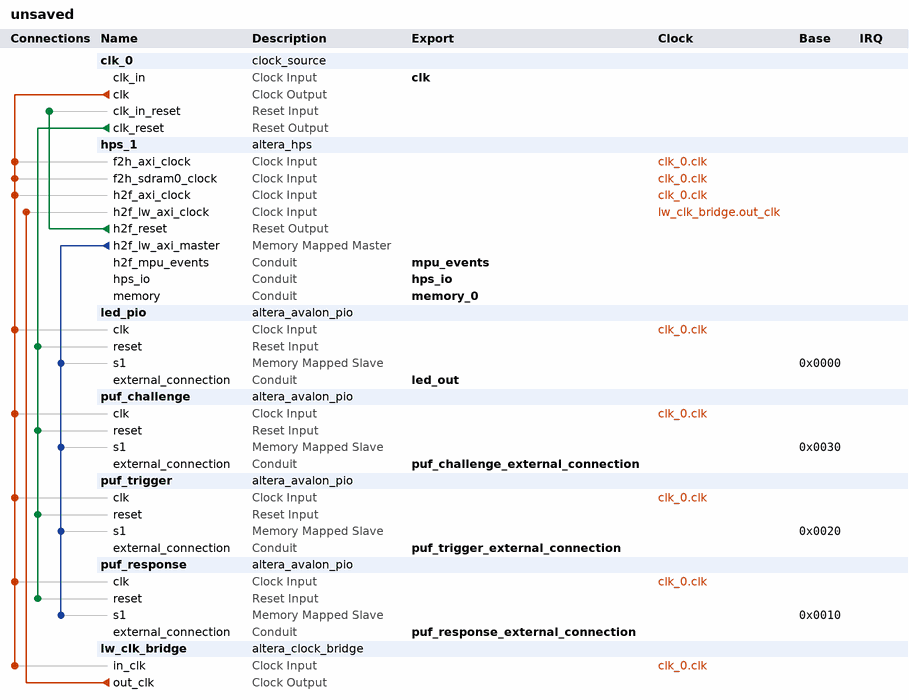
[diagram p0: system contents]
# Platform Designer (Qsys) system unsaved, Cyclone V 5CSEMA5F31C6
# Parameters at their usual value, and those the tool derives, are not listed.
package require -exact qsys 18.1
create_system unsaved
set_project_property DEVICE_FAMILY {Cyclone V}
set_project_property DEVICE 5CSEMA5F31C6

add_instance clk_0 clock_source 18.1
set_instance_parameter_value clk_0 clockFrequency 50000000

add_instance hps_1 altera_hps 18.1
set_instance_parameter_value hps_1 EMAC1_Mode RGMII
set_instance_parameter_value hps_1 EMAC1_PinMuxing {HPS I/O Set 0}
set_instance_parameter_value hps_1 F2SCLK_COLDRST_Enable false
set_instance_parameter_value hps_1 F2SCLK_DBGRST_Enable false
set_instance_parameter_value hps_1 F2SCLK_WARMRST_Enable false
set_instance_parameter_value hps_1 F2SDRAM_Type AXI-3
set_instance_parameter_value hps_1 F2SDRAM_Width 64
set_instance_parameter_value hps_1 F2SINTERRUPT_Enable false
set_instance_parameter_value hps_1 F2S_Width 2
set_instance_parameter_value hps_1 FPGA_PERIPHERAL_OUTPUT_CLOCK_FREQ_EMAC0_GTX_CLK 125
set_instance_parameter_value hps_1 FPGA_PERIPHERAL_OUTPUT_CLOCK_FREQ_EMAC0_MD_CLK 2.5
set_instance_parameter_value hps_1 FPGA_PERIPHERAL_OUTPUT_CLOCK_FREQ_EMAC1_GTX_CLK 125
set_instance_parameter_value hps_1 FPGA_PERIPHERAL_OUTPUT_CLOCK_FREQ_EMAC1_MD_CLK 2.5
set_instance_parameter_value hps_1 HPS_PROTOCOL DDR3
set_instance_parameter_value hps_1 I2C0_Mode N/A
set_instance_parameter_value hps_1 I2C0_PinMuxing Unused
set_instance_parameter_value hps_1 I2C1_Mode N/A
set_instance_parameter_value hps_1 I2C1_PinMuxing Unused
set_instance_parameter_value hps_1 LWH2F_Enable true
set_instance_parameter_value hps_1 MEM_BANKADDR_WIDTH 3
set_instance_parameter_value hps_1 MEM_CLK_FREQ 300.0
set_instance_parameter_value hps_1 MEM_CLK_FREQ_MAX 400.0
set_instance_parameter_value hps_1 MEM_COL_ADDR_WIDTH 10
set_instance_parameter_value hps_1 MEM_DQ_WIDTH 8
set_instance_parameter_value hps_1 MEM_DRV_STR RZQ/6
set_instance_parameter_value hps_1 MEM_ROW_ADDR_WIDTH 14
set_instance_parameter_value hps_1 MEM_RTT_NOM RZQ/6
set_instance_parameter_value hps_1 MEM_RTT_WR {Dynamic ODT off}
set_instance_parameter_value hps_1 MEM_TCL 7
set_instance_parameter_value hps_1 MEM_TFAW_NS 40.0
set_instance_parameter_value hps_1 MEM_TRAS_NS 37.5
set_instance_parameter_value hps_1 MEM_TRCD_NS 12.5
set_instance_parameter_value hps_1 MEM_TRFC_NS 110.0
set_instance_parameter_value hps_1 MEM_TRP_NS 12.5
set_instance_parameter_value hps_1 MEM_TRRD_NS 13.2
set_instance_parameter_value hps_1 MEM_TRTP_NS 13.2
set_instance_parameter_value hps_1 MEM_VENDOR JEDEC
set_instance_parameter_value hps_1 MEM_WTCL 6
set_instance_parameter_value hps_1 MPU_EVENTS_Enable true
set_instance_parameter_value hps_1 QSPI_Mode N/A
set_instance_parameter_value hps_1 QSPI_PinMuxing Unused
set_instance_parameter_value hps_1 REF_CLK_FREQ 125.0
set_instance_parameter_value hps_1 S2FCLK_USER2CLK 5
set_instance_parameter_value hps_1 S2F_Width 2
set_instance_parameter_value hps_1 SDIO_Mode {4-bit Data}
set_instance_parameter_value hps_1 SDIO_PinMuxing {HPS I/O Set 0}
set_instance_parameter_value hps_1 SPIM1_Mode N/A
set_instance_parameter_value hps_1 SPIM1_PinMuxing Unused
set_instance_parameter_value hps_1 STM_Enable false
set_instance_parameter_value hps_1 TIMING_BOARD_AC_SKEW 0.02
set_instance_parameter_value hps_1 TIMING_BOARD_AC_TO_CK_SKEW 0.0
set_instance_parameter_value hps_1 TIMING_BOARD_DQ_TO_DQS_SKEW 0.0
set_instance_parameter_value hps_1 TIMING_BOARD_MAX_CK_DELAY 0.6
set_instance_parameter_value hps_1 TIMING_BOARD_MAX_DQS_DELAY 0.6
set_instance_parameter_value hps_1 TIMING_BOARD_SKEW_BETWEEN_DQS 0.02
set_instance_parameter_value hps_1 TIMING_BOARD_SKEW_CKDQS_DIMM_MAX 0.01
set_instance_parameter_value hps_1 TIMING_BOARD_SKEW_CKDQS_DIMM_MIN -0.01
set_instance_parameter_value hps_1 TIMING_BOARD_SKEW_WITHIN_DQS 0.02
set_instance_parameter_value hps_1 TIMING_TDH 150
set_instance_parameter_value hps_1 TIMING_TDQSCK 400
set_instance_parameter_value hps_1 TIMING_TDQSQ 200
set_instance_parameter_value hps_1 TIMING_TDS 75
set_instance_parameter_value hps_1 TIMING_TIH 275
set_instance_parameter_value hps_1 TIMING_TIS 200
set_instance_parameter_value hps_1 TIMING_TQSH 0.38
set_instance_parameter_value hps_1 UART0_Mode {No Flow Control}
set_instance_parameter_value hps_1 UART0_PinMuxing {HPS I/O Set 0}
set_instance_parameter_value hps_1 USB1_Mode N/A
set_instance_parameter_value hps_1 USB1_PinMuxing Unused
set_instance_parameter_value hps_1 desired_cfg_clk_mhz 100.0
set_instance_parameter_value hps_1 desired_qspi_clk_mhz 400.0

add_instance led_pio altera_avalon_pio 18.1
set_instance_parameter_value led_pio direction Output
set_instance_parameter_value led_pio width 10

add_instance puf_challenge altera_avalon_pio 18.1
set_instance_parameter_value puf_challenge direction Output
set_instance_parameter_value puf_challenge width 4

add_instance puf_trigger altera_avalon_pio 18.1
set_instance_parameter_value puf_trigger direction Output
set_instance_parameter_value puf_trigger width 1

add_instance puf_response altera_avalon_pio 18.1
set_instance_parameter_value puf_response direction Input
set_instance_parameter_value puf_response width 2

add_instance lw_clk_bridge altera_clock_bridge 18.1
set_instance_parameter_value lw_clk_bridge DERIVED_CLOCK_RATE 50000000
set_instance_parameter_value lw_clk_bridge EXPLICIT_CLOCK_RATE 0

# connections
add_connection clk_0.clk hps_1.f2h_axi_clock clock
add_connection clk_0.clk hps_1.f2h_sdram0_clock clock
add_connection clk_0.clk hps_1.h2f_axi_clock clock
add_connection clk_0.clk led_pio.clk clock
add_connection clk_0.clk lw_clk_bridge.in_clk clock
add_connection clk_0.clk puf_challenge.clk clock
add_connection clk_0.clk puf_response.clk clock
add_connection clk_0.clk puf_trigger.clk clock
add_connection lw_clk_bridge.out_clk hps_1.h2f_lw_axi_clock clock
add_connection clk_0.clk_reset led_pio.reset reset
add_connection clk_0.clk_reset puf_challenge.reset reset
add_connection clk_0.clk_reset puf_response.reset reset
add_connection clk_0.clk_reset puf_trigger.reset reset
add_connection hps_1.h2f_reset clk_0.clk_in_reset reset
add_connection hps_1.h2f_lw_axi_master led_pio.s1 avalon
set_connection_parameter_value hps_1.h2f_lw_axi_master/led_pio.s1 baseAddress 0x0000
add_connection hps_1.h2f_lw_axi_master puf_challenge.s1 avalon
set_connection_parameter_value hps_1.h2f_lw_axi_master/puf_challenge.s1 baseAddress 0x0030
add_connection hps_1.h2f_lw_axi_master puf_response.s1 avalon
set_connection_parameter_value hps_1.h2f_lw_axi_master/puf_response.s1 baseAddress 0x0010
add_connection hps_1.h2f_lw_axi_master puf_trigger.s1 avalon
set_connection_parameter_value hps_1.h2f_lw_axi_master/puf_trigger.s1 baseAddress 0x0020

# exported interfaces
add_interface clk clock sink
set_interface_property clk EXPORT_OF clk_0.clk_in
add_interface hps_io conduit end
set_interface_property hps_io EXPORT_OF hps_1.hps_io
add_interface led_out conduit end
set_interface_property led_out EXPORT_OF led_pio.external_connection
add_interface memory_0 conduit end
set_interface_property memory_0 EXPORT_OF hps_1.memory
add_interface mpu_events conduit end
set_interface_property mpu_events EXPORT_OF hps_1.h2f_mpu_events
add_interface puf_challenge_external_connection conduit end
set_interface_property puf_challenge_external_connection EXPORT_OF puf_challenge.external_connection
add_interface puf_response_external_connection conduit end
set_interface_property puf_response_external_connection EXPORT_OF puf_response.external_connection
add_interface puf_trigger_external_connection conduit end
set_interface_property puf_trigger_external_connection EXPORT_OF puf_trigger.external_connection

set_interconnect_requirement {$system} qsys_mm.clockCrossingAdapter HANDSHAKE
set_interconnect_requirement {$system} qsys_mm.enableEccProtection FALSE
set_interconnect_requirement {$system} qsys_mm.insertDefaultSlave TRUE
set_interconnect_requirement {$system} qsys_mm.maxAdditionalLatency 1

save_system unsaved.qsys
